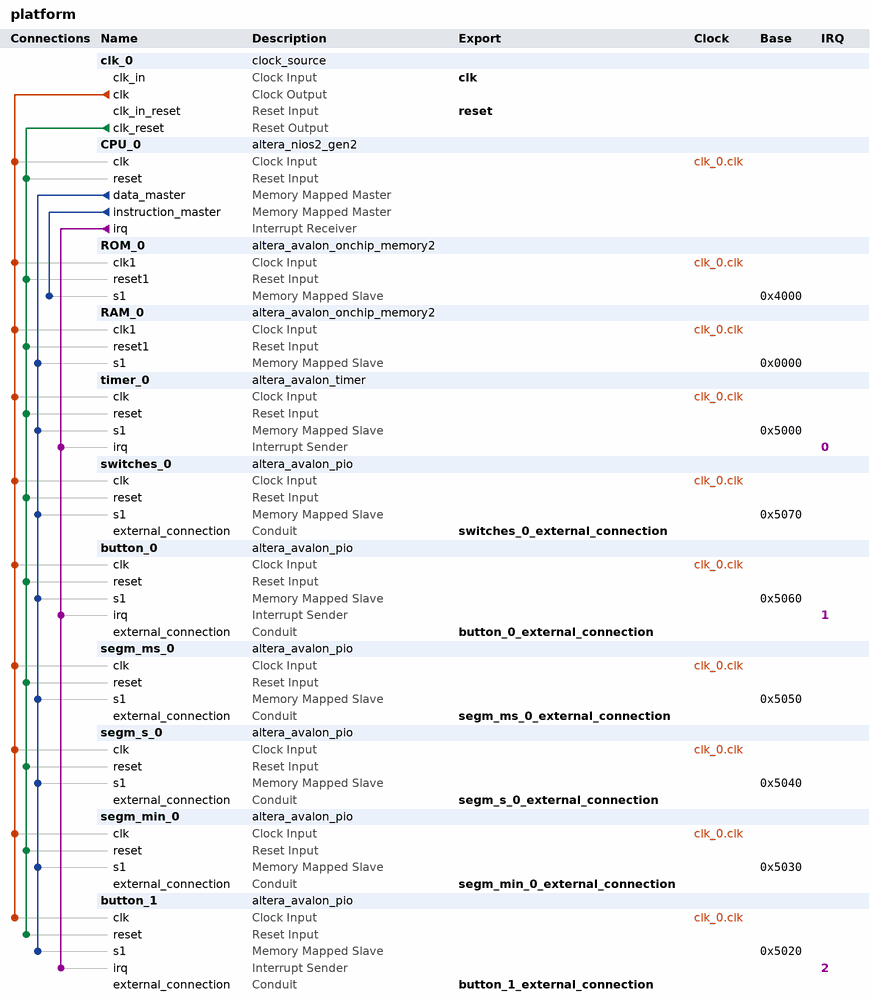
[diagram p0: system contents]
# Platform Designer (Qsys) system platform, Cyclone V 5CSEMA5F31C6
# Parameters at their usual value, and those the tool derives, are not listed.
package require -exact qsys 20.1
create_system platform
set_project_property DEVICE_FAMILY {Cyclone V}
set_project_property DEVICE 5CSEMA5F31C6

add_instance clk_0 clock_source 20.1
set_instance_parameter_value clk_0 clockFrequency 50000000

add_instance CPU_0 altera_nios2_gen2 20.1
set_instance_parameter_value CPU_0 dcache_size 2048
set_instance_parameter_value CPU_0 debug_enabled false
set_instance_parameter_value CPU_0 exceptionSlave ROM_0.s1
set_instance_parameter_value CPU_0 icache_size 4096
set_instance_parameter_value CPU_0 impl Tiny
set_instance_parameter_value CPU_0 resetSlave ROM_0.s1

add_instance ROM_0 altera_avalon_onchip_memory2 20.1
set_instance_parameter_value ROM_0 dataWidth 32
set_instance_parameter_value ROM_0 dualPort false
set_instance_parameter_value ROM_0 initMemContent true
set_instance_parameter_value ROM_0 initializationFileName onchip_mem.hex
set_instance_parameter_value ROM_0 memorySize 4096
set_instance_parameter_value ROM_0 writable false

add_instance RAM_0 altera_avalon_onchip_memory2 20.1
set_instance_parameter_value RAM_0 dataWidth 32
set_instance_parameter_value RAM_0 dualPort false
set_instance_parameter_value RAM_0 initMemContent true
set_instance_parameter_value RAM_0 initializationFileName onchip_mem.hex
set_instance_parameter_value RAM_0 memorySize 16384

add_instance timer_0 altera_avalon_timer 20.1
set_instance_parameter_value timer_0 alwaysRun true
set_instance_parameter_value timer_0 fixedPeriod true
set_instance_parameter_value timer_0 period 1
set_instance_parameter_value timer_0 periodUnits MSEC
set_instance_parameter_value timer_0 snapshot false

add_instance switches_0 altera_avalon_pio 20.1
set_instance_parameter_value switches_0 direction Input
set_instance_parameter_value switches_0 width 2

add_instance button_0 altera_avalon_pio 20.1
set_instance_parameter_value button_0 captureEdge true
set_instance_parameter_value button_0 direction Input
set_instance_parameter_value button_0 edgeType FALLING
set_instance_parameter_value button_0 generateIRQ true
set_instance_parameter_value button_0 irqType EDGE
set_instance_parameter_value button_0 width 1

add_instance segm_ms_0 altera_avalon_pio 20.1
set_instance_parameter_value segm_ms_0 direction Output
set_instance_parameter_value segm_ms_0 width 14

add_instance segm_s_0 altera_avalon_pio 20.1
set_instance_parameter_value segm_s_0 direction Output
set_instance_parameter_value segm_s_0 width 14

add_instance segm_min_0 altera_avalon_pio 20.1
set_instance_parameter_value segm_min_0 direction Output
set_instance_parameter_value segm_min_0 width 14

add_instance button_1 altera_avalon_pio 20.1
set_instance_parameter_value button_1 captureEdge true
set_instance_parameter_value button_1 direction Input
set_instance_parameter_value button_1 edgeType FALLING
set_instance_parameter_value button_1 generateIRQ true
set_instance_parameter_value button_1 irqType EDGE
set_instance_parameter_value button_1 width 1

# connections
add_connection clk_0.clk button_0.clk clock
add_connection clk_0.clk button_1.clk clock
add_connection clk_0.clk CPU_0.clk clock
add_connection clk_0.clk RAM_0.clk1 clock
add_connection clk_0.clk ROM_0.clk1 clock
add_connection clk_0.clk segm_min_0.clk clock
add_connection clk_0.clk segm_ms_0.clk clock
add_connection clk_0.clk segm_s_0.clk clock
add_connection clk_0.clk switches_0.clk clock
add_connection clk_0.clk timer_0.clk clock
add_connection clk_0.clk_reset button_0.reset reset
add_connection clk_0.clk_reset button_1.reset reset
add_connection clk_0.clk_reset CPU_0.reset reset
add_connection clk_0.clk_reset RAM_0.reset1 reset
add_connection clk_0.clk_reset ROM_0.reset1 reset
add_connection clk_0.clk_reset segm_min_0.reset reset
add_connection clk_0.clk_reset segm_ms_0.reset reset
add_connection clk_0.clk_reset segm_s_0.reset reset
add_connection clk_0.clk_reset switches_0.reset reset
add_connection clk_0.clk_reset timer_0.reset reset
add_connection CPU_0.data_master button_0.s1 avalon
set_connection_parameter_value CPU_0.data_master/button_0.s1 baseAddress 0x5060
add_connection CPU_0.data_master button_1.s1 avalon
set_connection_parameter_value CPU_0.data_master/button_1.s1 baseAddress 0x5020
add_connection CPU_0.data_master RAM_0.s1 avalon
set_connection_parameter_value CPU_0.data_master/RAM_0.s1 baseAddress 0x0000
add_connection CPU_0.data_master segm_min_0.s1 avalon
set_connection_parameter_value CPU_0.data_master/segm_min_0.s1 baseAddress 0x5030
add_connection CPU_0.data_master segm_ms_0.s1 avalon
set_connection_parameter_value CPU_0.data_master/segm_ms_0.s1 baseAddress 0x5050
add_connection CPU_0.data_master segm_s_0.s1 avalon
set_connection_parameter_value CPU_0.data_master/segm_s_0.s1 baseAddress 0x5040
add_connection CPU_0.data_master switches_0.s1 avalon
set_connection_parameter_value CPU_0.data_master/switches_0.s1 baseAddress 0x5070
add_connection CPU_0.data_master timer_0.s1 avalon
set_connection_parameter_value CPU_0.data_master/timer_0.s1 baseAddress 0x5000
add_connection CPU_0.instruction_master ROM_0.s1 avalon
set_connection_parameter_value CPU_0.instruction_master/ROM_0.s1 baseAddress 0x4000
add_connection CPU_0.irq button_0.irq interrupt
set_connection_parameter_value CPU_0.irq/button_0.irq irqNumber 1
add_connection CPU_0.irq button_1.irq interrupt
set_connection_parameter_value CPU_0.irq/button_1.irq irqNumber 2
add_connection CPU_0.irq timer_0.irq interrupt
set_connection_parameter_value CPU_0.irq/timer_0.irq irqNumber 0

# exported interfaces
add_interface button_0_external_connection conduit end
set_interface_property button_0_external_connection EXPORT_OF button_0.external_connection
add_interface button_1_external_connection conduit end
set_interface_property button_1_external_connection EXPORT_OF button_1.external_connection
add_interface clk clock sink
set_interface_property clk EXPORT_OF clk_0.clk_in
add_interface reset reset sink
set_interface_property reset EXPORT_OF clk_0.clk_in_reset
add_interface segm_min_0_external_connection conduit end
set_interface_property segm_min_0_external_connection EXPORT_OF segm_min_0.external_connection
add_interface segm_ms_0_external_connection conduit end
set_interface_property segm_ms_0_external_connection EXPORT_OF segm_ms_0.external_connection
add_interface segm_s_0_external_connection conduit end
set_interface_property segm_s_0_external_connection EXPORT_OF segm_s_0.external_connection
add_interface switches_0_external_connection conduit end
set_interface_property switches_0_external_connection EXPORT_OF switches_0.external_connection

set_interconnect_requirement {$system} qsys_mm.clockCrossingAdapter HANDSHAKE
set_interconnect_requirement {$system} qsys_mm.enableEccProtection FALSE
set_interconnect_requirement {$system} qsys_mm.insertDefaultSlave FALSE
set_interconnect_requirement {$system} qsys_mm.maxAdditionalLatency 1

save_system platform.qsys
